# Altium project BATT_ctrl_v2.1.PrjPcb
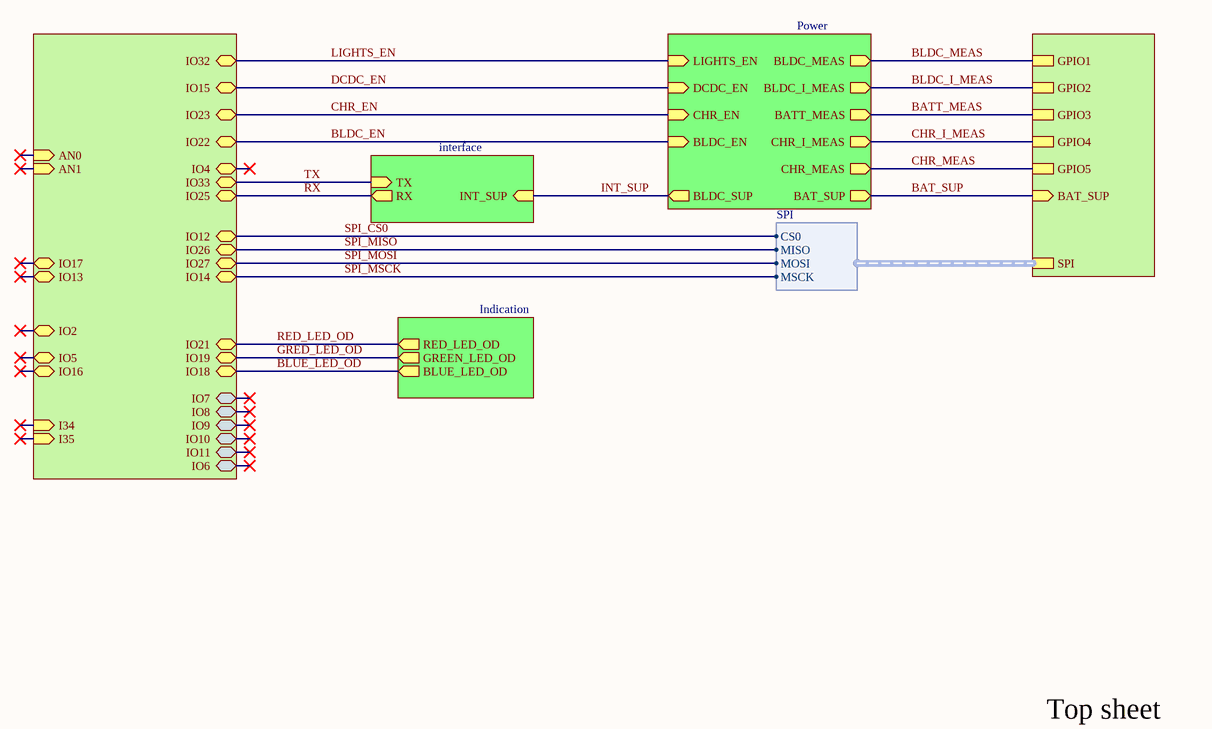
[diagram p0: top_sheet.SchDoc]
3 sheets, 66 parts. Net scope: hierarchical (ports join the sheet entries above them; power ports are global).
Board file: batt_ctrl_pcb_v2.1.PcbDoc
Sheets:
  top_sheet.SchDoc
    Power = power.SchDoc
    interface = data_interface.SchDoc

## Sheet top_sheet.SchDoc
size A4; SheetNumber: 1; SheetTotal: 7

### Sub-sheets
Indication = indication.SchDoc (file not in this document): RED_LED_OD (out), GREEN_LED_OD (out), BLUE_LED_OD (out)
interface = data_interface.SchDoc: TX (in), RX (out), INT_SUP (in)
Power = power.SchDoc: BLDC_EN (in), BLDC_I_MEAS (out), CHR_EN (in), CHR_I_MEAS (out), BLDC_MEAS (out), CHR_MEAS (out), BATT_MEAS (out), BAT_SUP (out), DCDC_EN (in), BLDC_SUP (out), LIGHTS_EN (in)
U_ESP32_WROOM2 = ESP32_WROOM2 (file not in this document): IO25 (bidir), IO26 (bidir), IO27 (bidir), IO22 (bidir), IO23 (bidir), IO32 (bidir), IO19 (bidir), IO21 (bidir), IO33 (bidir), IO14 (bidir), IO12 (bidir), IO15 (bidir), IO16 (bidir), IO17 (bidir), IO18 (bidir), IO13 (bidir), I34 (in), I35 (in), IO5 (bidir), IO4 (bidir), IO2 (bidir), AN0 (in), AN1 (in), IO7 (bidir), IO8 (bidir), IO9 (bidir), IO10 (bidir), IO11 (bidir), IO6 (bidir)
U_LTC6804-2_BMS_TR = LTC6804-2_BMS_TR (file not in this document): SPI (harness SPI), GPIO1, GPIO2, GPIO3, GPIO4, GPIO5, BAT_SUP (in)

### Harnesses
SPI: CS0, MISO, MOSI, MSCK

### Nets
BAT_SUP: sheet Power/BAT_SUP, sheet U_LTC6804-2_BMS_TR/BAT_SUP
BATT_MEAS: sheet Power/BATT_MEAS, sheet U_LTC6804-2_BMS_TR/GPIO3
BLDC_EN: sheet U_ESP32_WROOM2/IO22, sheet Power/BLDC_EN
BLDC_I_MEAS: sheet Power/BLDC_I_MEAS, sheet U_LTC6804-2_BMS_TR/GPIO2
BLDC_MEAS: sheet Power/BLDC_MEAS, sheet U_LTC6804-2_BMS_TR/GPIO1
BLUE_LED_OD: sheet U_ESP32_WROOM2/IO18, sheet Indication/BLUE_LED_OD
CHR_EN: sheet U_ESP32_WROOM2/IO23, sheet Power/CHR_EN
CHR_I_MEAS: sheet Power/CHR_I_MEAS, sheet U_LTC6804-2_BMS_TR/GPIO4
CHR_MEAS: sheet Power/CHR_MEAS, sheet U_LTC6804-2_BMS_TR/GPIO5
DCDC_EN: sheet U_ESP32_WROOM2/IO15, sheet Power/DCDC_EN
GRED_LED_OD: sheet U_ESP32_WROOM2/IO19, sheet Indication/GREEN_LED_OD
INT_SUP: sheet Power/BLDC_SUP, sheet interface/INT_SUP  [project net BLDC_POS]
LIGHTS_EN: sheet U_ESP32_WROOM2/IO32, sheet Power/LIGHTS_EN
RED_LED_OD: sheet U_ESP32_WROOM2/IO21, sheet Indication/RED_LED_OD
RX: sheet U_ESP32_WROOM2/IO25, sheet interface/RX
SPI_CS0: sheet U_ESP32_WROOM2/IO12, sheet U_LTC6804-2_BMS_TR/SPI.CS0
SPI_MISO: sheet U_ESP32_WROOM2/IO26, sheet U_LTC6804-2_BMS_TR/SPI.MISO
SPI_MOSI: sheet U_ESP32_WROOM2/IO27, sheet U_LTC6804-2_BMS_TR/SPI.MOSI
SPI_MSCK: sheet U_ESP32_WROOM2/IO14, sheet U_LTC6804-2_BMS_TR/SPI.MSCK
TX: sheet U_ESP32_WROOM2/IO33, sheet interface/TX

### Notes on the sheet
- Top sheet

## Sheet power.SchDoc
size A4; SheetNumber: 2; SheetTotal: 7
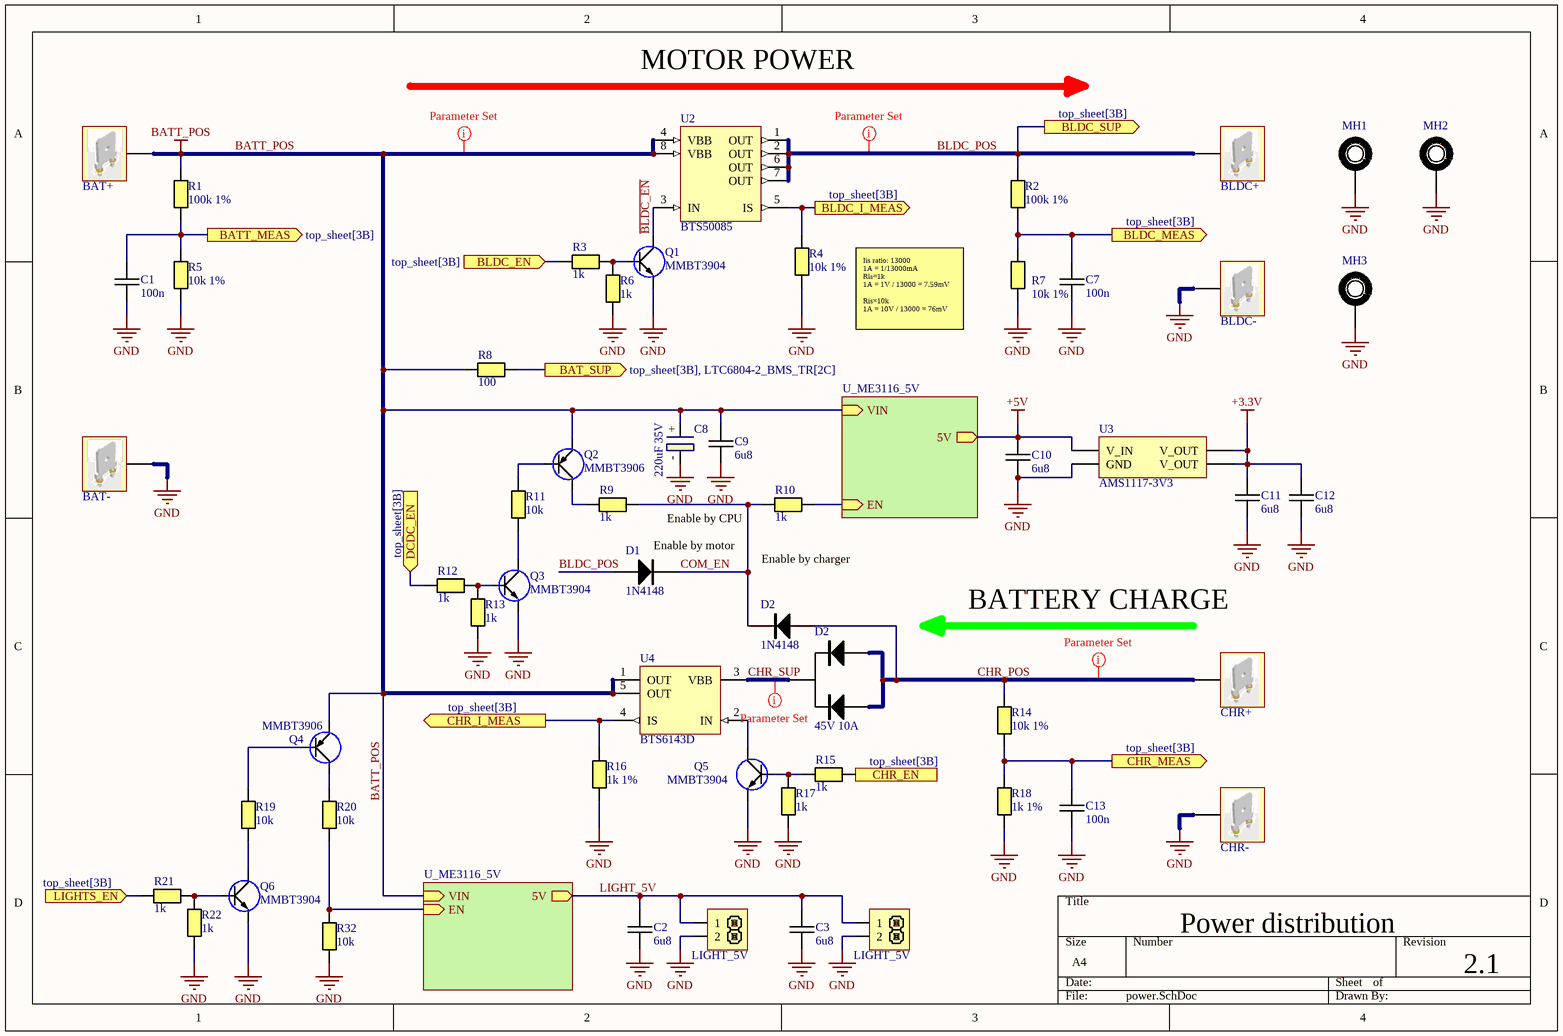
[diagram p1: power.SchDoc]

### Parts
(Parts that share a designator on the sheet are numbered #1, #2 ... from top to bottom, then left to right.)
BAT+  Crimp 6.3 single PCB  [Crimp 6.3mm single PCB]  (value not drawn)
BAT-  Crimp 6.3 single PCB  [Crimp 6.3mm single PCB]  (value not drawn)
BLDC+  Crimp 6.3 single PCB  [Crimp 6.3mm single PCB]  (value not drawn)
BLDC-  Crimp 6.3 single PCB  [Crimp 6.3mm single PCB]  (value not drawn)
C1  100n  [CAPC0603(1608)55_N]
C2  6u8  [CAPC0805(2012)75_N]
C3  6u8  [CAPC0805(2012)75_N]
C7  100n  [CAPC0603(1608)55_N]
C8  220uF 35V  [10x10.5 Capacitor]
C9  6u8  [CAPC0805(2012)75_N]
C10  6u8  [CAPC0805(2012)75_N]
C11  6u8  [CAPC0805(2012)75_N]
C12  6u8  [CAPC0805(2012)75_N]
C13  100n  [CAPC0603(1608)55_N]
CHR+  Crimp 6.3 single PCB  [Crimp 6.3mm single PCB]  (value not drawn)
CHR-  Crimp 6.3 single PCB  [Crimp 6.3mm single PCB]  (value not drawn)
CN1  PIN HEADER 1x2  [XH2.54 2P]  (value not drawn)
CN2  PIN HEADER 1x2  [XH2.54 2P]  (value not drawn)
D1  1N4148  [SOD80]
D2#1  1N4148  [SOD80]
D2#2  45V 10A  [DPAK]
MH1  Mounting Hole  [MH_M3]  (value not drawn)
MH2  Mounting Hole  [MH_M3]  (value not drawn)
MH3  Mounting Hole  [MH_M3]  (value not drawn)
Q1  MMBT3904  [SOT23]
Q2  MMBT3906  [SOT23]
Q3  MMBT3904  [SOT23]
Q4  MMBT3906  [SOT23]
Q5  MMBT3904  [SOT23]
Q6  MMBT3904  [SOT23]
R1  100k 1%  [RESC0603(1608)_N]
R2  100k 1%  [RESC0603(1608)_N]
R3  1k  [RESC0603(1608)_N]
R4  10k 1%  [RESC0603(1608)_N]
R5  10k 1%  [RESC0603(1608)_N]
R6  1k  [RESC0603(1608)_N]
R7  10k 1%  [RESC0603(1608)_N]
R8  100  [RESC0603(1608)_N]
R9  1k  [RESC0603(1608)_N]
R10  1k  [RESC0603(1608)_N]
R11  10k  [RESC0603(1608)_N]
R12  1k  [RESC0603(1608)_N]
R13  1k  [RESC0603(1608)_N]
R14  10k 1%  [RESC0603(1608)_N]
R15  1k  [RESC0603(1608)_N]
R16  1k 1%  [RESC0603(1608)_N]
R17  1k  [RESC0603(1608)_N]
R18  1k 1%  [RESC0603(1608)_N]
R19  10k  [RESC0603(1608)_N]
R20  10k  [RESC0603(1608)_N]
R21  1k  [RESC0603(1608)_N]
R22  1k  [RESC0603(1608)_N]
R32  10k  [RESC0603(1608)_N]
U2  BTS50085  [PG-TO220-7-4]
U3  AMS1117-3V3  [SOT229P700X180-4N]
U4  BTS6143D  [ITO252-5-11_M]

### Sub-sheets
U_ME3116_5V = ME3116_5V (file not in this document): EN (in), VIN (in), 5V (out)
U_ME3116_5V = ME3116_5V (file not in this document): EN (in), VIN (in), 5V (out)

### Ports
BAT_SUP (out, see top_sheet[3B], LTC6804-2_BMS_TR[2C]), BATT_MEAS (out, see top_sheet[3B]), BLDC_EN (in, see top_sheet[3B]), BLDC_I_MEAS (out, see top_sheet[3B]), BLDC_MEAS (out, see top_sheet[3B]), BLDC_SUP (out, see top_sheet[3B]), CHR_EN (in, see top_sheet[3B]), CHR_I_MEAS (out, see top_sheet[3B]), CHR_MEAS (out, see top_sheet[3B]), DCDC_EN (in, see top_sheet[3B]), LIGHTS_EN (in, see top_sheet[3B])

### Nets
+3.3V: C11.1 C12.1 U3.2(V_OUT) U3.4(V_OUT)
+5V: C10.1 U3.3(V_IN) ; sheet U_ME3116_5V/5V
BATT_POS: BAT+.1 C8.+ C9.2 Q2.2(E) Q4.2(E) R1.2 R8.2 U2.4(VBB) U2.8(VBB) U4.1(OUT) U4.5(OUT) ; sheet U_ME3116_5V/VIN, sheet U_ME3116_5V/VIN
GND: BAT-.1 BLDC-.1 C1.2 C2.2 C3.2 C7.2 C8.- C9.1 C10.2 C11.2 C12.2 C13.2 CHR-.1 CN1.2 CN2.2 MH1.1 MH2.1 MH3.1 Q1.2(E) Q3.2(E) Q5.2(E) Q6.2(E) R4.1 R5.1 R6.1 R7.1 R13.1 R16.1 R17.1 R18.1 R22.1 R32.1 U3.1(GND)
~{BLDC_EN}: Q1.3(C) U2.3(IN)
BAT_SUP: R8.1 ; port BAT_SUP
BATT_MEAS: C1.1 R1.1 R5.2 ; port BATT_MEAS
BLDC_EN: R3.1 ; port BLDC_EN
BLDC_I_MEAS: R4.2 U2.5(IS) ; port BLDC_I_MEAS
BLDC_MEAS: C7.1 R2.1 R7.2 ; port BLDC_MEAS
BLDC_POS: BLDC+.1 D1.1(A) R2.2 U2.1(OUT) U2.2(OUT) U2.6(OUT) U2.7(OUT) ; port BLDC_SUP
CHR_EN: R15.1 ; port CHR_EN
CHR_I_MEAS: R16.2 U4.4(IS) ; port CHR_I_MEAS
CHR_MEAS: C13.1 R14.1 R18.2 ; port CHR_MEAS
CHR_POS: CHR+.1 D2#1.1(A) D2#2.1(A1) D2#2.3(A2) R14.2
CHR_SUP: D2#2.2(K) U4.3(VBB)
COM_EN: D1.2(K) D2#1.2(K) R9.1 R10.2
DCDC_EN: R12.1 ; port DCDC_EN
LIGHT_5V: C2.1 C3.1 CN1.1 CN2.1 ; sheet U_ME3116_5V/5V
LIGHTS_EN: R21.1 ; port LIGHTS_EN
NetQ1_1: Q1.1(B) R3.2 R6.2
NetQ2_1: Q2.1(B) R11.1
NetQ2_3: Q2.3(C) R9.2
NetQ3_1: Q3.1(B) R12.2 R13.2
NetQ3_3: Q3.3(C) R11.2
NetQ4_1: Q4.1(B) R19.2
NetQ4_3: Q4.3(C) R20.2
NetQ5_1: Q5.1(B) R15.2 R17.2
NetQ5_3: Q5.3(C) U4.2(IN)
NetQ6_1: Q6.1(B) R21.2 R22.2
NetQ6_3: Q6.3(C) R19.1
NetR10_1: R10.1 ; sheet U_ME3116_5V/EN
NetR20_1: R20.1 R32.2 ; sheet U_ME3116_5V/EN

### Layout directives
net class Direct; net class HV: BATT_POS, BLDC_POS, CHR_POS, CHR_SUP

### Notes on the sheet
- MOTOR POWER
- Iis ratio: 13000
  1A = 1/13000mA
  Ris=1k
  1A = 1V / 13000 = 7.59mV
  Ris=10k
  1A = 10V / 13000 = 76mV
- Enable by CPU
- (near D1) Enable by motor
- Enable by charger
- BATTERY CHARGE
- Power distribution
- 2.1

### Library data of the parts
BAT+ BAT- BLDC+ BLDC- CHR+ CHR- = Crimp 6.3 single PCB: Straight Mount Angle PCB Tab Terminal
  BAT- BLDC- CHR-: ClassName: DirectGND
C1-C3 C7 C9-C13 = Capacitor M: Ceramic capacitor Medium density
  C1 C7 C13: Value: 100n
  C2 C3 C9-C12: Value: 6u8
C8 = Capacitor Electrolitic: Value: 220uF 35V
CN1 CN2 = PIN HEADER 2.54 1x2: LIGHT_5V; Parameter 1: LIGHT_5V
D1 D2#1 = 1N4148: Small Signal Fast Switching Diodes; Repetitive peak reverse voltage: 100 V; Reverse voltage: 75 V; Peak forward surge current: 2 A; Repetitive peak forward current: 500 mA; Forward continuous current: 300 mA; Average forward current: 150 mA; Diode capacitance: 4 pF; Reverse recovery time: 4 ~ 8 ns; Supplier 1: Mouser; Supplier Part Number 1: 78-MCL4148
D2#2 = STPS1045B: Power schottky rectifier; V: 45V; I: 10A
Q1 Q3 Q5 Q6 = 2N3904: NPN General Purpose Transistor; Collector-Emitter Voltage: 40V; Collector-Base Voltage: 60V; Collector Current - Continuous: 200mA; DC Current Gain: 300
Q2 Q4 = 2N3906: PNP General Purpose Transistor; Collector-Emitter Voltage: -40V; Collector-Base Voltage: -60V; Collector Current - Continuous: 200mA; DC Current Gain: 300
R1-R22 R32 = Resistor M: Resistor Medium Density
  R1 R2: Value: 100k 1%
  R3 R6 R9 R10 R12 R13 R15 R17 R21 R22: Value: 1k
  R4 R5 R7 R14: Value: 10k 1%
  R8: Value: 100
  R11 R19 R20 R32: Value: 10k
  R16 R18: Value: 1k 1%
U2 = BTS50085-1TMA: Smart Highside High Current Power Switch; Overvoltage protection: 70V; Output clamp: 62V; Operating voltage: 5.0 .. 58V; On-state resistance: 9 mOhm; Load current (ISO): 44A; Short circuit current limitation: 90A; Current sense ratio: 13000
U3 = AMS1117: 800mA LDO  15V max
U4 = BTS6143D: PROFET Smart Highside Power Switch, 1 Channel, 10 A Load Current, -40 to 150 degC, PG-TO252-5-11, Reel, Green; Manufacturer: Infineon; Recommended Operating Voltage Min.: 5.5 V; RON(max) @ 150degreesC: 18 mOhm; toff (max): 500 us; Load Current (typ): 10 A; RON @ 25degreesC: 10 mOhm; Recommended Operating Voltage Max.: 38 V; Green: TRUE; Ptot (max): 59 W; Group: Automotive Qualified; Channels: 1; Packing: Reel; ComponentLink1URL: http://www.infineon.com/; PartNumber: BTS6143D; Mounting Technology: Surface Mount; ComponentLink2Description: Datasheet; ComponentLink3URL: http://www.infineon.com/dgdl/TLE7276-Data+Sheet-+v1_11.pdf?folderId=db3a304412b407950112b408e8c90004&fileId=db3a304412b407950112b436c53f66c8&sId=db3a30433db6f09f013dc0e43c0428c1; ComponentLink3Description: Package Specification; ComponentLink2URL: http://www.infineon.com/dgdl/BTS6143D_DS_v10.pdf?folderId=db3a304314dca389011537739e37155f&fileId=db3a3043183a95550118606a2705368e&location=en.Products.Automotive_ICs.Smart_High-_and_Low-Side_Switches.PROFET__-_Smart_High_Side_Switches.DATASHEET.BTS6143D_D; ComponentLink1Description: Manufacturer URL; PackageVersion: Nov-10; PackageDescription: 5-Pin Plastic (Green) Transistor Single Outline Package, 6.5 x 6.12 mm Body, 1.14 mm Pitch; Halogen-free: TRUE; DatasheetVersion: Rev. 1.0; PackageReference: PG-TO252-5-11; ton (max): 500 us
MH1-MH3 = Mounting Hole: ClassName: DirectGND

## Sheet data_interface.SchDoc
size A4; SheetNumber: 3; SheetTotal: 6
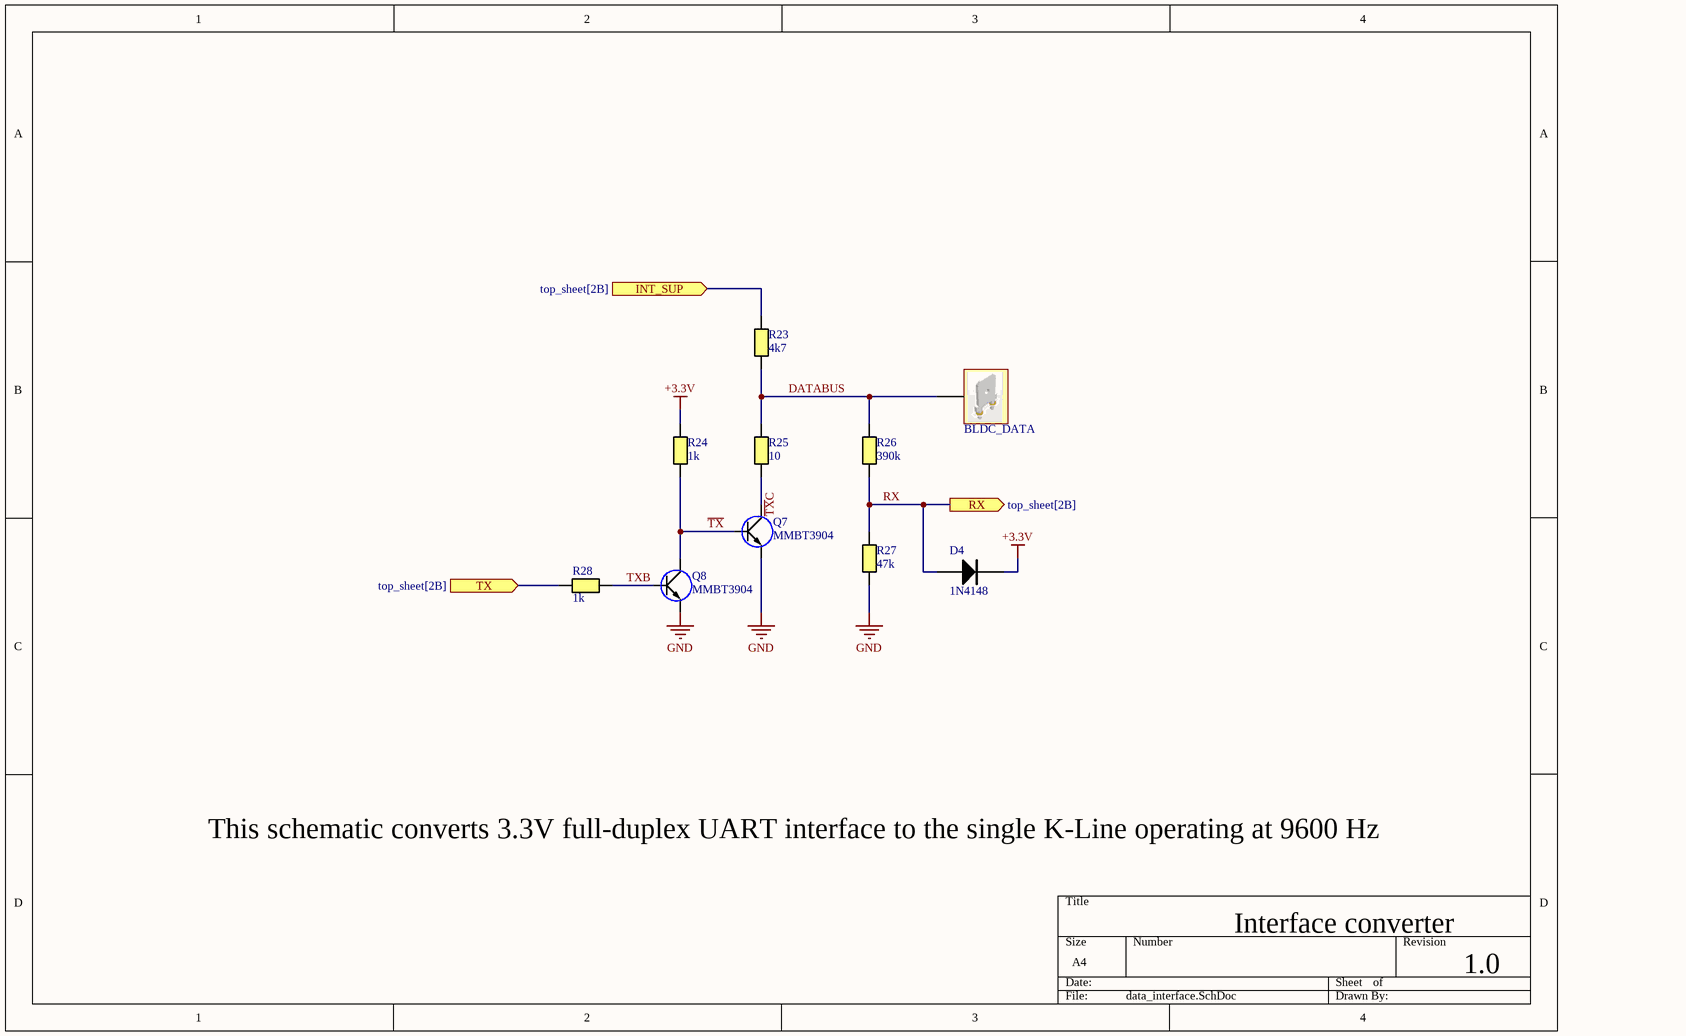
[diagram p2: data_interface.SchDoc]

### Parts
BLDC_DATA  Crimp 6.3 single PCB  [Crimp 6.3mm single PCB]  (value not drawn)
D4  1N4148  [SOD80]
Q7  MMBT3904  [SOT23]
Q8  MMBT3904  [SOT23]
R23  4k7  [RESC0603(1608)_N]
R24  1k  [RESC0603(1608)_N]
R25  10  [RESC0603(1608)_N]
R26  390k  [RESC0603(1608)_N]
R27  47k  [RESC0603(1608)_N]
R28  1k  [RESC0603(1608)_N]

### Ports
INT_SUP (in, see top_sheet[2B]), RX (out, see top_sheet[2B]), TX (in, see top_sheet[2B])

### Nets
+3.3V: D4.2(K) R24.2
GND: Q7.2(E) Q8.2(E) R27.1
BLDC_POS: R23.2 ; port INT_SUP
DATABUS: BLDC_DATA.1 R23.1 R25.2 R26.2
RX: D4.1(A) R26.1 R27.2 ; port RX
~{TX}: Q7.1(B) Q8.3(C) R24.1
~{TX}C: Q7.3(C) R25.1
TX: R28.1 ; port TX
TXB: Q8.1(B) R28.2

### Notes on the sheet
- This schematic converts 3.3V full-duplex UART interface to the single K-Line operating at 9600 Hz
- Interface converter
- 1.0

### Library data of the parts
BLDC_DATA = Crimp 6.3 single PCB: Straight Mount Angle PCB Tab Terminal
D4 = 1N4148: as D1 on sheet power; Supplier 1: Mouser; Supplier Part Number 1: 78-MCL4148
Q7 Q8 = 2N3904: as Q1 on sheet power
R23-R28 = Resistor M: Resistor Medium Density
  R23: Value: 4k7
  R24 R28: Value: 1k
  R25: Value: 10
  R26: Value: 390k
  R27: Value: 47k

## Nets that join several sheets
+3.3V: power (C11.1 C12.1 U3.2 U3.4), data_interface (D4.2 R24.2)
GND: power (33 pins), data_interface (Q7.2 Q8.2 R27.1)
BLDC_POS: power (7 pins), data_interface (R23.2)